# Altium schematic sheet MCU.SchDoc
size A4
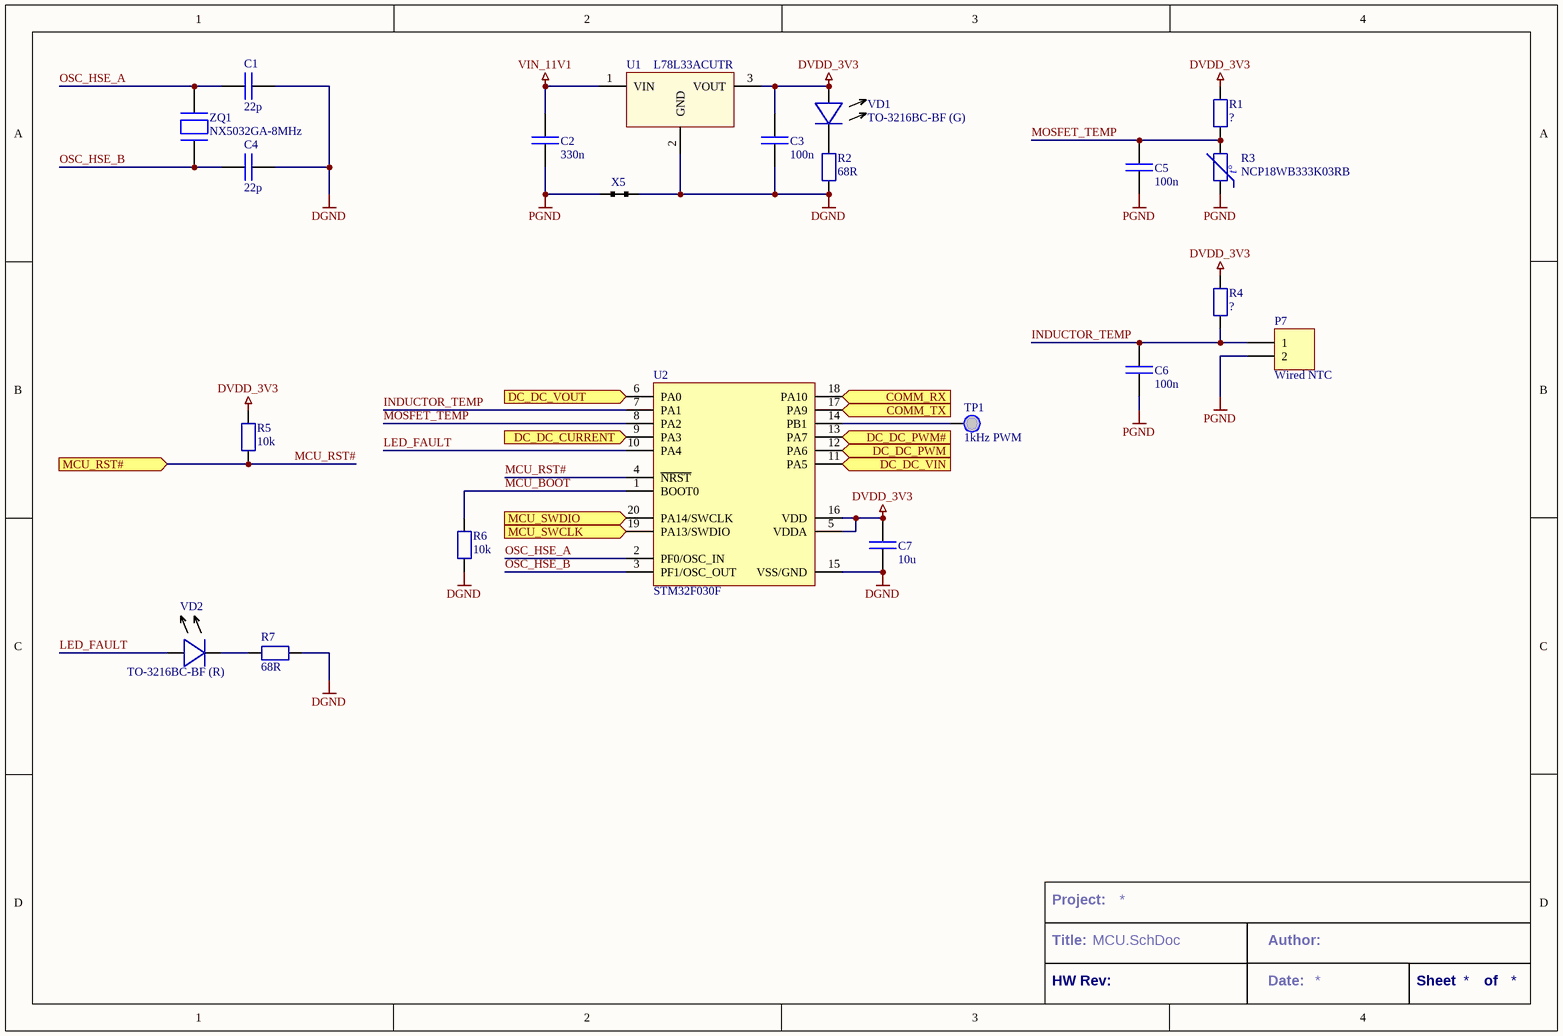
[diagram p0: MCU.SchDoc]

## Parts
C1  22p  [C_0603/1608]
C2  330n  [C_0805/2012]
C3  100n  [C_0805/2012]
C4  22p  [C_0603/1608]
C5  100n  [C_0603/1608]
C6  100n  [C_0603/1608]
C7  10u  [C_0603/1608]
P7  Wired NTC  [HDR_SMD_1X2_1.50]
R1  ?  [R_0603/1608]
R2  68R  [R_0603/1608]
R3  NCP18WB333K03RB  [R_0603/1608]
R4  ?  [R_0603/1608]
R5  10k  [R_0603/1608]
R6  10k  [R_0603/1608]
R7  68R  [R_0603/1608]
TP1  1kHz PWM  [TP_SMD_D1.00]  (no BOM)
U1  L78L33ACUTR  [SOT89]
U2  STM32F030F  [TSSOP20]
VD1  TO-3216BC-BF (G)  [LED_0603/1608]
VD2  TO-3216BC-BF (R)  [LED_0603/1608]
X5  (no value)  [NET_TIE_0.8]  (net tie, no BOM)
ZQ1  NX5032GA-8MHz  [OSC_2PINS SMD]

## Ports
COMM_RX, COMM_TX, DC_DC_CURRENT, DC_DC_PWM, DC_DC_PWM#, DC_DC_VIN, DC_DC_VOUT, MCU_RST#, MCU_SWCLK, MCU_SWDIO

## Nets
DGND: C1.2 C3.2 C4.2 C7.2 R2.1 R6.1 R7.2 U1.2(GND) U2.15(VSS/GND) X5.2
DVDD_3V3: C3.1 C7.1 R1.2 R4.2 R5.2 U1.3(VOUT) U2.5(VDDA) U2.16(VDD) VD1.A(Anode)
PGND: C2.2 C5.2 C6.2 P7.2 R3.1 X5.1
VIN_11V1: C2.1 U1.1(VIN)
COMM_RX: U2.18(PA10) ; port COMM_RX
COMM_TX: U2.17(PA9) ; port COMM_TX
DC_DC_CURRENT: U2.9(PA3) ; port DC_DC_CURRENT
DC_DC_PWM: U2.12(PA6) ; port DC_DC_PWM
DC_DC_PWM#: U2.13(PA7) ; port DC_DC_PWM#
DC_DC_VIN: U2.11(PA5) ; port DC_DC_VIN
DC_DC_VOUT: U2.6(PA0) ; port DC_DC_VOUT
INDUCTOR_TEMP: C6.1 P7.1 R4.1 U2.7(PA1)
LED_FAULT: U2.10(PA4) VD2.A(Anode)
MCU_BOOT: R6.2 U2.1(BOOT0)
MCU_RST#: R5.1 U2.4(~{NRST}) ; port MCU_RST#
MCU_SWCLK: U2.19(PA13/SWDIO) ; port MCU_SWCLK
MCU_SWDIO: U2.20(PA14/SWCLK) ; port MCU_SWDIO
MOSFET_TEMP: C5.1 R1.1 R3.2 U2.8(PA2)
OSC_HSE_A: C1.1 U2.2(PF0/OSC_IN) ZQ1.2
OSC_HSE_B: C4.1 U2.3(PF1/OSC_OUT) ZQ1.1
NetR2_2: R2.2 VD1.C(Cathode)
NetR7_1: R7.1 VD2.C(Cathode)
NetTP1_1: TP1.1 U2.14(PB1)

Not connected (* = marked no-connect by the designer): U2 0(EP)

## Notes on the sheet
- Project:
- Title:
- HW Rev:
- Author:
- Date:
- Sheet
- of
- (in symbol Termistor) t°

## Library data of the parts
C1-C7 = Capacitor: Non-polarized capacitor
P7 = Header 2: Header, 2-Pin; LatestRevisionDate: 17-Jul-2002; LatestRevisionNote: Re-released for DXP Platform.; Publisher: Altium Limited
R1 R2 R4-R7 = Resistor
R3 = Termistor
TP1 = Test point
U1 = L78L: LDO voltage regulator
U2 = STM32F030F: 32-bit Cortex-M0
VD1 VD2 = LED
X5 = Net tie
ZQ1 = Crystal oscillator